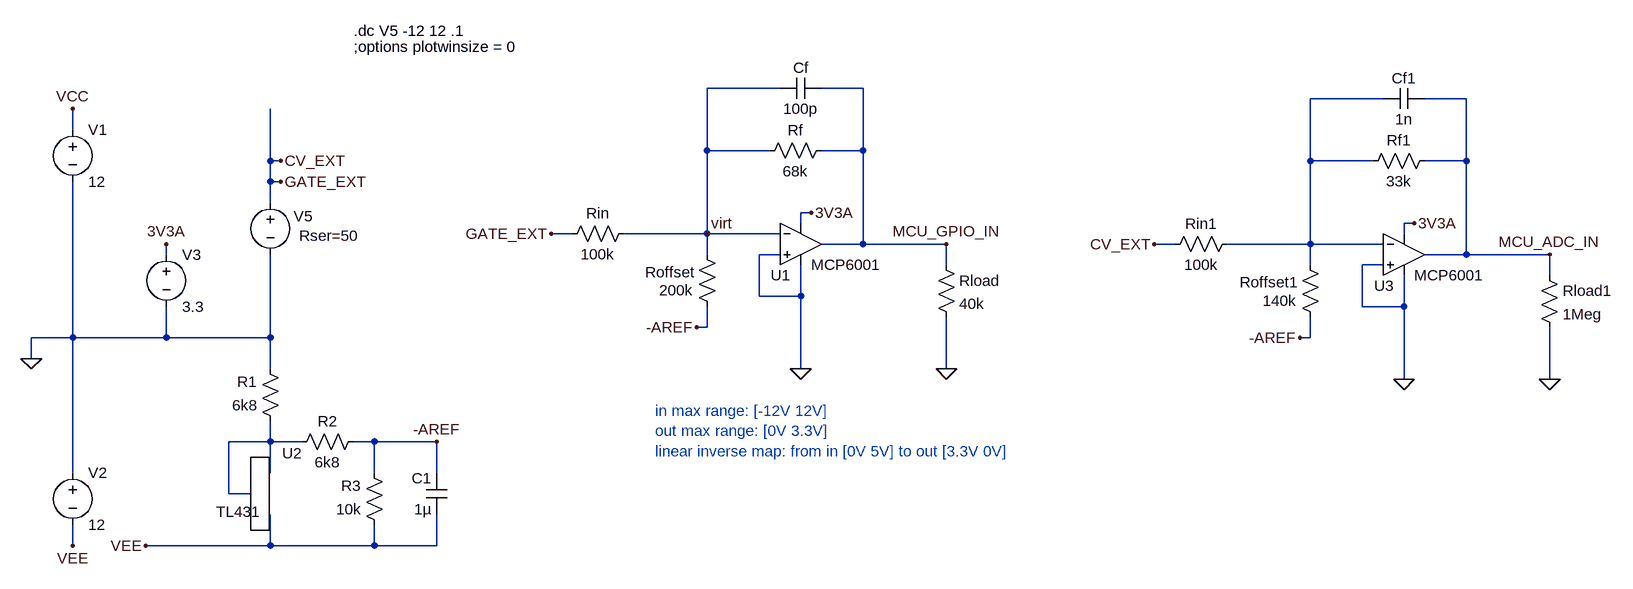
[diagram p0: schematic gateIn.asc]
gateIn.asc, the LTspice schematic file:
Version 4
SHEET 1 1296 680
WIRE -592 -448 -704 -448
WIRE -464 -448 -528 -448
WIRE 336 -432 224 -432
WIRE 464 -432 400 -432
WIRE -1680 -384 -1680 -416
WIRE -704 -352 -704 -448
WIRE -608 -352 -704 -352
WIRE -464 -352 -464 -448
WIRE -464 -352 -528 -352
WIRE -1376 -336 -1376 -416
WIRE -1360 -336 -1376 -336
WIRE 224 -336 224 -432
WIRE 320 -336 224 -336
WIRE 464 -336 464 -432
WIRE 464 -336 400 -336
WIRE -1376 -304 -1376 -336
WIRE -1360 -304 -1376 -304
WIRE -1376 -272 -1376 -304
WIRE -544 -256 -560 -256
WIRE -560 -240 -560 -256
WIRE 384 -240 368 -240
WIRE -912 -224 -944 -224
WIRE -704 -224 -704 -352
WIRE -704 -224 -832 -224
WIRE -592 -224 -704 -224
WIRE 368 -224 368 -240
WIRE -464 -208 -464 -352
WIRE -464 -208 -528 -208
WIRE -336 -208 -464 -208
WIRE 16 -208 -16 -208
WIRE 224 -208 224 -336
WIRE 224 -208 96 -208
WIRE 336 -208 224 -208
WIRE -1536 -192 -1536 -208
WIRE -704 -192 -704 -224
WIRE -592 -192 -624 -192
WIRE 464 -192 464 -336
WIRE 464 -192 400 -192
WIRE 592 -192 464 -192
WIRE -336 -176 -336 -208
WIRE 224 -176 224 -208
WIRE 336 -176 304 -176
WIRE 592 -160 592 -192
WIRE -624 -128 -624 -192
WIRE -560 -128 -560 -176
WIRE -560 -128 -624 -128
WIRE 304 -112 304 -176
WIRE 368 -112 368 -160
WIRE 368 -112 304 -112
WIRE -704 -80 -704 -112
WIRE -704 -80 -720 -80
WIRE -1680 -64 -1680 -304
WIRE -1680 -64 -1744 -64
WIRE -1536 -64 -1536 -112
WIRE -1536 -64 -1680 -64
WIRE -1376 -64 -1376 -192
WIRE -1376 -64 -1536 -64
WIRE 224 -64 224 -96
WIRE 224 -64 208 -64
WIRE -1744 -32 -1744 -64
WIRE -1376 -16 -1376 -64
WIRE -560 -16 -560 -128
WIRE -336 -16 -336 -96
WIRE 368 0 368 -112
WIRE 592 0 592 -80
WIRE -1376 96 -1376 64
WIRE -1376 96 -1440 96
WIRE -1328 96 -1376 96
WIRE -1216 96 -1248 96
WIRE -1120 96 -1216 96
WIRE -1680 144 -1680 -64
WIRE -1376 144 -1376 96
WIRE -1216 144 -1216 96
WIRE -1120 144 -1120 96
WIRE -1440 176 -1440 96
WIRE -1408 176 -1440 176
WIRE -1680 256 -1680 224
WIRE -1376 256 -1376 208
WIRE -1376 256 -1568 256
WIRE -1216 256 -1216 224
WIRE -1216 256 -1376 256
WIRE -1120 256 -1120 208
WIRE -1120 256 -1216 256
FLAG -1680 -416 VCC
FLAG -1744 -32 0
FLAG -1680 256 VEE
FLAG -1536 -208 3V3A
FLAG -544 -256 3V3A
FLAG -704 -224 virt
FLAG -336 -208 MCU_GPIO_IN
FLAG -1360 -304 GATE_EXT
FLAG -1120 96 -AREF
FLAG -1568 256 VEE
FLAG -720 -80 -AREF
FLAG -560 -16 0
FLAG -944 -224 GATE_EXT
FLAG -336 -16 0
FLAG 384 -240 3V3A
FLAG 592 -192 MCU_ADC_IN
FLAG 208 -64 -AREF
FLAG 368 0 0
FLAG -16 -208 CV_EXT
FLAG 592 0 0
FLAG -1360 -336 CV_EXT
SYMBOL res -512 -368 R90
WINDOW 0 0 56 VBottom 2
WINDOW 3 32 56 VTop 2
SYMATTR InstName Rf
SYMATTR Value 68k
SYMBOL res -688 -96 R180
WINDOW 0 35 69 Left 2
WINDOW 3 37 41 Left 2
SYMATTR InstName Roffset
SYMATTR Value 200k
SYMBOL res -816 -240 R90
WINDOW 0 0 56 VBottom 2
WINDOW 3 32 56 VTop 2
SYMATTR InstName Rin
SYMATTR Value 100k
SYMBOL cap -528 -464 R90
WINDOW 0 0 32 VBottom 2
WINDOW 3 32 32 VTop 2
SYMATTR InstName Cf
SYMATTR Value 100p
SYMBOL res -352 -192 R0
SYMATTR InstName Rload
SYMATTR Value 40k
SYMBOL voltage -1680 -400 R0
WINDOW 123 0 0 Left 0
WINDOW 39 0 0 Left 0
SYMATTR InstName V1
SYMATTR Value 12
SYMBOL voltage -1680 128 R0
WINDOW 123 0 0 Left 0
WINDOW 39 0 0 Left 0
SYMATTR InstName V2
SYMATTR Value 12
SYMBOL voltage -1536 -208 R0
WINDOW 123 0 0 Left 0
WINDOW 39 0 0 Left 0
SYMATTR InstName V3
SYMATTR Value 3.3
SYMBOL voltage -1376 -288 R0
WINDOW 3 24 101 Left 2
WINDOW 123 24 44 Left 2
WINDOW 39 44 67 Left 2
WINDOW 0 36 37 Left 2
SYMATTR Value ""
SYMATTR SpiceLine Rser=50
SYMATTR InstName V5
SYMBOL ZZZ\\OpAmp\\MCP6001 -560 -272 R0
WINDOW 0 -46 112 Left 2
SYMATTR InstName U1
SYMBOL ZZZ\\REF\\TL431 -1392 144 R0
WINDOW 3 -67 60 Left 2
SYMATTR InstName U2
SYMBOL res -1360 80 R180
WINDOW 0 36 76 Left 2
WINDOW 3 36 40 Left 2
SYMATTR InstName R1
SYMATTR Value 6k8
SYMBOL res -1232 80 R90
WINDOW 0 0 56 VBottom 2
WINDOW 3 32 56 VTop 2
SYMATTR InstName R2
SYMATTR Value 6k8
SYMBOL res -1200 240 R180
WINDOW 0 36 76 Left 2
WINDOW 3 36 40 Left 2
SYMATTR InstName R3
SYMATTR Value 10k
SYMBOL cap -1104 208 R180
WINDOW 0 24 56 Left 2
WINDOW 3 24 8 Left 2
SYMATTR InstName C1
SYMATTR Value 1µ
SYMBOL res 416 -352 R90
WINDOW 0 0 56 VBottom 2
WINDOW 3 32 56 VTop 2
SYMATTR InstName Rf1
SYMATTR Value 33k
SYMBOL res 240 -80 R180
WINDOW 0 35 69 Left 2
WINDOW 3 37 41 Left 2
SYMATTR InstName Roffset1
SYMATTR Value 140k
SYMBOL res 112 -224 R90
WINDOW 0 0 56 VBottom 2
WINDOW 3 32 56 VTop 2
SYMATTR InstName Rin1
SYMATTR Value 100k
SYMBOL cap 400 -448 R90
WINDOW 0 0 32 VBottom 2
WINDOW 3 32 32 VTop 2
SYMATTR InstName Cf1
SYMATTR Value 1n
SYMBOL res 576 -176 R0
SYMATTR InstName Rload1
SYMATTR Value 1Meg
SYMBOL ZZZ\\OpAmp\\MCP6001 368 -256 R0
WINDOW 0 -46 112 Left 2
SYMATTR InstName U3
TEXT -1248 -536 Left 2 !.dc V5 -12 12 .1
TEXT -1248 -512 Left 2 !;options plotwinsize = 0
TEXT -784 48 Left 2 ;in max range: [-12V 12V]\nout max range: [0V 3.3V]\nlinear inverse map: from in [0V 5V] to out [3.3V 0V]

The netlist it stands for:
* gateIn.asc
Rf MCU_GPIO_IN virt 68k
Roffset -AREF virt 200k
Rin virt CV_EXT 100k
Cf MCU_GPIO_IN virt 100p
Rload MCU_GPIO_IN 0 40k
V1 VCC 0 12
V2 0 VEE 12
V3 3V3A 0 3.3
V5 CV_EXT 0 Rser=50
* U1: MCP6001 (symbol ZZZ\OpAmp\MCP6001 not available, pins judged from their places): In+=0 In-=virt V+=3V3A V-=0 OUT=MCU_GPIO_IN
XU2 N002 VEE N002 TL431
R1 N002 0 6k8
R2 -AREF N002 6k8
R3 VEE -AREF 10k
C1 VEE -AREF 1µ
Rf1 MCU_ADC_IN N001 33k
Roffset1 -AREF N001 140k
Rin1 N001 CV_EXT 100k
Cf1 MCU_ADC_IN N001 1n
Rload1 MCU_ADC_IN 0 1Meg
* U3: MCP6001 (symbol ZZZ\OpAmp\MCP6001 not available, pins judged from their places): In+=0 In-=N001 V+=3V3A V-=0 OUT=MCU_ADC_IN
.dc V5 -12 12 .1
;options plotwinsize = 0
* in max range: [-12V 12V]
* out max range: [0V 3.3V]
* linear inverse map: from in [0V 5V] to out [3.3V 0V]
.lib TL431.mod
.backanno
.end